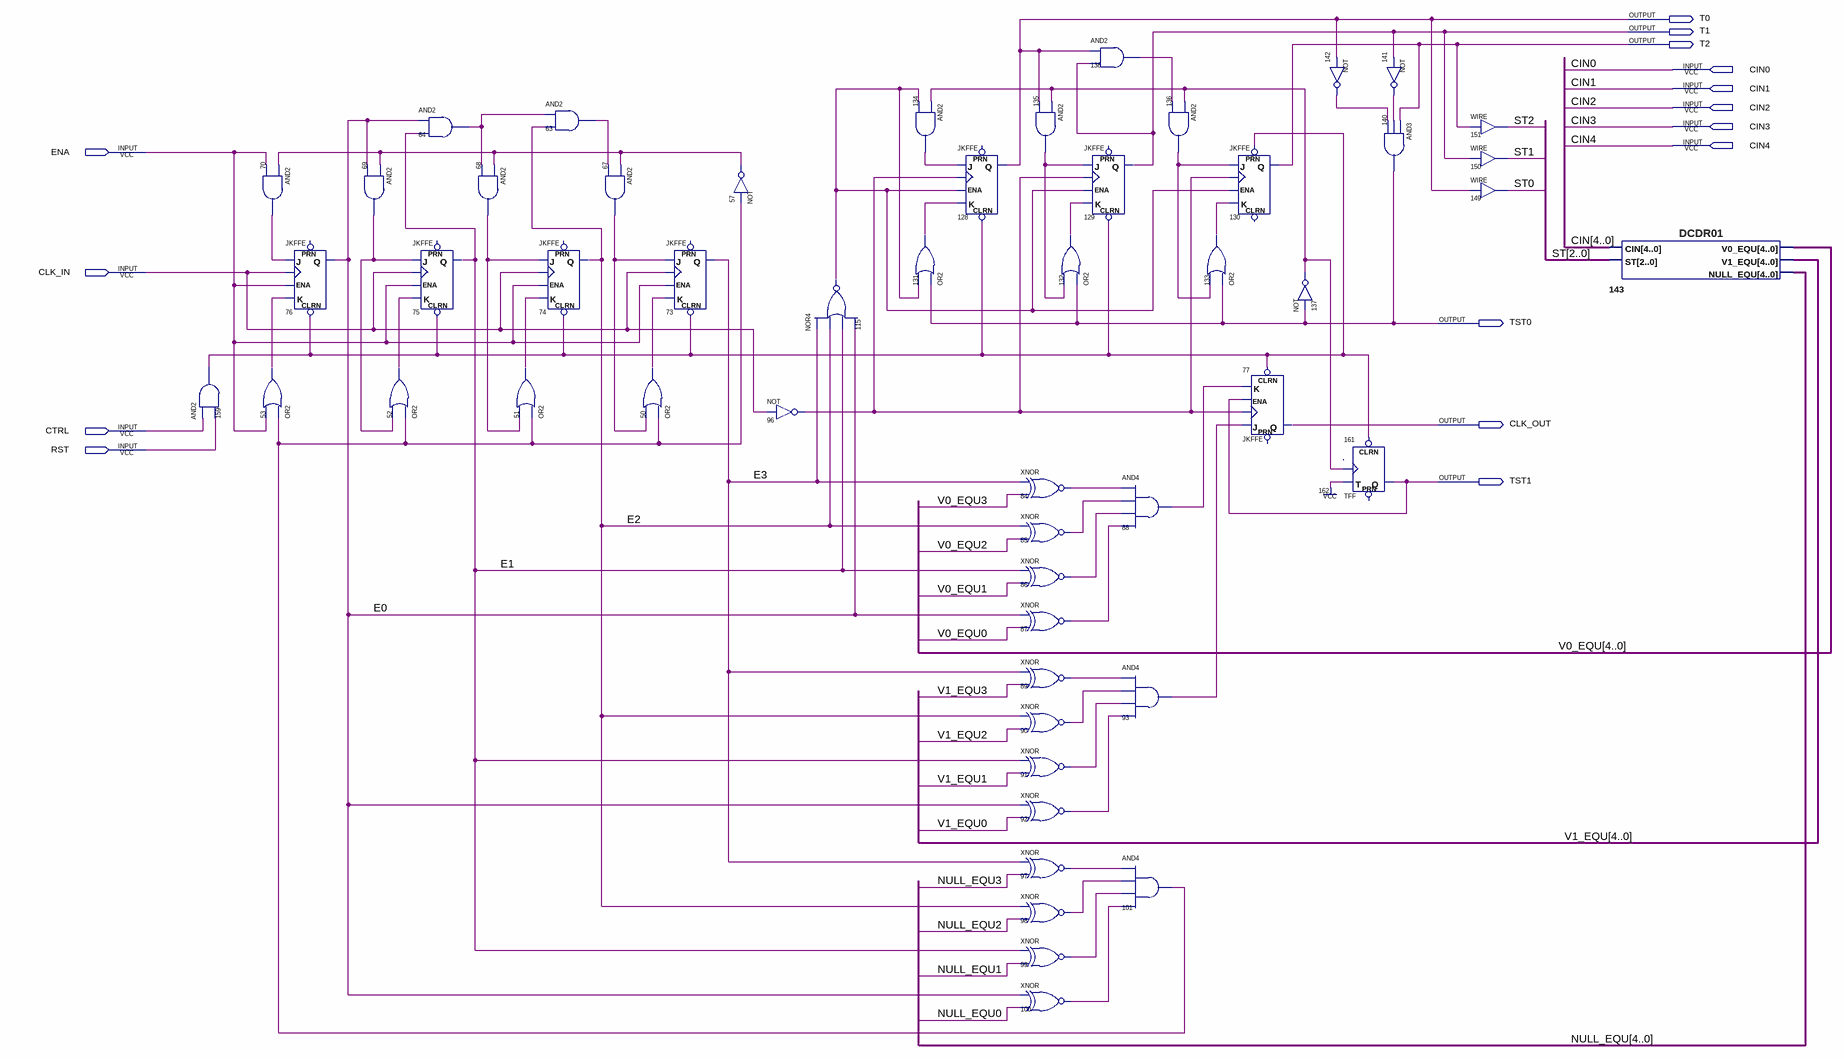
[diagram p0: schematic sheet]
// Quartus schematic codeind.bdf as structural Verilog: 53 symbols, 15 pins
module codeind (
  input  CIN0,
  input  CIN1,
  input  CIN2,
  input  CIN3,
  input  CIN4,
  input  ENA,
  input  CLK_IN,
  input  CTRL,
  input  RST,
  output T0,
  output T1,
  output T2,
  output TST0,
  output CLK_OUT,
  output TST1
);

  wire E0, E1, E2, E3, n50_out, n51_out, n52_out, n53_out, n57_out, n63_out, n64_out, n67_out, n68_out,
       n69_out, n70_out, n84_out, n85_out, n86_out, n87_out, n88_out, n89_out, n90_out, n91_out, n92_out,
       n93_out, n96_out, n97_out, n98_out, n99_out, n100_out, n101_out, n115_out, n131_out, n132_out,
       n133_out, n134_out, n135_out, n136_out, n137_out, n138_out, n141_out, n142_out, n159_out;
  wire [2:0] ST;
  wire [4:0] NULL_EQU, V0_EQU, V1_EQU;

  and u_159 (n159_out, CTRL, RST);
  and u_70 (n70_out, n57_out, ENA);
  JKFFE u_76 (.J(n70_out), .CLK(CLK_IN), .CLRN(n159_out), .K(n53_out), .ENA(ENA), .Q(E0));  // open: PRN
  or u_53 (n53_out, n101_out, ENA);
  and u_69 (n69_out, n57_out, E0);
  or u_52 (n52_out, n101_out, n69_out);
  and u_64 (n64_out, E0, E1);
  JKFFE u_75 (.J(n69_out), .CLK(CLK_IN), .CLRN(n159_out), .K(n52_out), .ENA(ENA), .Q(E1));  // open: PRN
  and u_68 (n68_out, n57_out, n64_out);
  and u_63 (n63_out, n64_out, E2);
  JKFFE u_74 (.J(n68_out), .CLK(CLK_IN), .CLRN(n159_out), .K(n51_out), .ENA(ENA), .Q(E2));  // open: PRN
  or u_51 (n51_out, n101_out, n68_out);
  and u_67 (n67_out, n57_out, n63_out);
  or u_50 (n50_out, n101_out, n67_out);
  JKFFE u_73 (.J(n67_out), .CLK(CLK_IN), .CLRN(n159_out), .K(n50_out), .ENA(ENA), .Q(E3));  // open: PRN
  not u_57 (n57_out, n101_out);
  not u_96 (n96_out, CLK_IN);
  nor u_115 (n115_out, E3, E2, E1, E0);
  and u_134 (n134_out, n137_out, n115_out);
  or u_131 (n131_out, TST0, n115_out);
  JKFFE u_128 (.J(n134_out), .CLK(n96_out), .CLRN(n159_out), .K(n131_out), .ENA(n115_out), .Q(T0));  // open: PRN
  and u_135 (n135_out, n137_out, T0);
  xnor u_84 (n84_out, E3, V0_EQU[3]);
  xnor u_85 (n85_out, E2, V0_EQU[2]);
  xnor u_86 (n86_out, E1, V0_EQU[1]);
  xnor u_87 (n87_out, E0, V0_EQU[0]);
  xnor u_89 (n89_out, E3, V1_EQU[3]);
  xnor u_90 (n90_out, E2, V1_EQU[2]);
  xnor u_91 (n91_out, E1, V1_EQU[1]);
  xnor u_92 (n92_out, E0, V1_EQU[0]);
  xnor u_97 (n97_out, E3, NULL_EQU[3]);
  xnor u_98 (n98_out, E2, NULL_EQU[2]);
  xnor u_99 (n99_out, E1, NULL_EQU[1]);
  xnor u_100 (n100_out, E0, NULL_EQU[0]);
  and u_138 (n138_out, T0, T1);
  JKFFE u_129 (.J(n135_out), .CLK(n96_out), .CLRN(n159_out), .K(n132_out), .ENA(n115_out), .Q(T1));  // open: PRN
  or u_132 (n132_out, TST0, n135_out);
  and u_88 (n88_out, n84_out, n85_out, n86_out, n87_out);
  and u_93 (n93_out, n89_out, n90_out, n91_out, n92_out);
  and u_101 (n101_out, n97_out, n98_out, n99_out, n100_out);
  and u_136 (n136_out, n137_out, n138_out);
  or u_133 (n133_out, TST0, n136_out);
  JKFFE u_130 (.PRN(n159_out), .J(n136_out), .CLK(n96_out), .K(n133_out), .ENA(n115_out), .Q(T2));  // open: CLRN
  JKFFE u_77 (.J(n93_out), .CLK(n96_out), .CLRN(n159_out), .K(n88_out), .ENA(TST1), .Q(CLK_OUT));  // open: PRN
  not u_137 (n137_out, TST0);
  not u_142 (n142_out, T0);
  TFF u_161 (.CLRN(n159_out), .T(1'b1), .CLK(n137_out), .Q(TST1));  // open: PRN
  not u_141 (n141_out, T1);
  and u_140 (TST0, T2, n141_out, n142_out);
  assign ST[2] = T2;  // WIRE 151
  assign ST[1] = T1;  // WIRE 150
  assign ST[0] = T0;  // WIRE 149
  DCDR01 u_143 (.CIN({CIN4, CIN3, CIN2, CIN1, CIN0}), .ST(ST), .V0_EQU(V0_EQU), .V1_EQU(V1_EQU), .NULL_EQU(NULL_EQU));
endmodule
